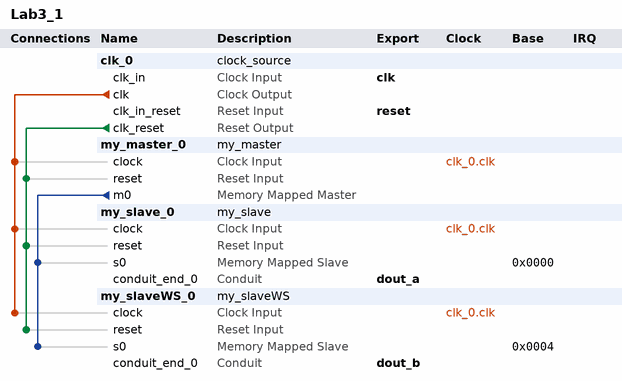
[diagram p0: system contents]
# Platform Designer (Qsys) system Lab3_1, Cyclone IV E EP4CE6E22C8
# Parameters at their usual value, and those the tool derives, are not listed.
package require -exact qsys 16.1
create_system Lab3_1
set_project_property DEVICE_FAMILY {Cyclone IV E}
set_project_property DEVICE EP4CE6E22C8

add_instance clk_0 clock_source 16.1
set_instance_parameter_value clk_0 clockFrequency 50000000
set_instance_parameter_value clk_0 resetSynchronousEdges DEASSERT

add_instance my_master_0 my_master 1.0
set_instance_parameter_value my_master_0 address_1 0
set_instance_parameter_value my_master_0 address_2 4
set_instance_parameter_value my_master_0 data_1 287454020
set_instance_parameter_value my_master_0 data_2 61166

add_instance my_slave_0 my_slave 1.0

add_instance my_slaveWS_0 my_slaveWS 1.0

# connections
add_connection clk_0.clk my_master_0.clock clock
add_connection clk_0.clk my_slave_0.clock clock
add_connection clk_0.clk my_slaveWS_0.clock clock
add_connection clk_0.clk_reset my_master_0.reset reset
add_connection clk_0.clk_reset my_slave_0.reset reset
add_connection clk_0.clk_reset my_slaveWS_0.reset reset
add_connection my_master_0.m0 my_slave_0.s0 avalon
set_connection_parameter_value my_master_0.m0/my_slave_0.s0 baseAddress 0x0000
add_connection my_master_0.m0 my_slaveWS_0.s0 avalon
set_connection_parameter_value my_master_0.m0/my_slaveWS_0.s0 baseAddress 0x0004

# exported interfaces
add_interface clk clock sink
set_interface_property clk EXPORT_OF clk_0.clk_in
add_interface dout_a conduit end
set_interface_property dout_a EXPORT_OF my_slave_0.conduit_end_0
add_interface dout_b conduit end
set_interface_property dout_b EXPORT_OF my_slaveWS_0.conduit_end_0
add_interface reset reset sink
set_interface_property reset EXPORT_OF clk_0.clk_in_reset

set_interconnect_requirement {$system} qsys_mm.clockCrossingAdapter HANDSHAKE
set_interconnect_requirement {$system} qsys_mm.enableEccProtection FALSE
set_interconnect_requirement {$system} qsys_mm.insertDefaultSlave FALSE
set_interconnect_requirement {$system} qsys_mm.maxAdditionalLatency 1

save_system Lab3_1.qsys
